# Altium project Alt_BRD_PowerModules.PrjPcb (part 2 of 2)
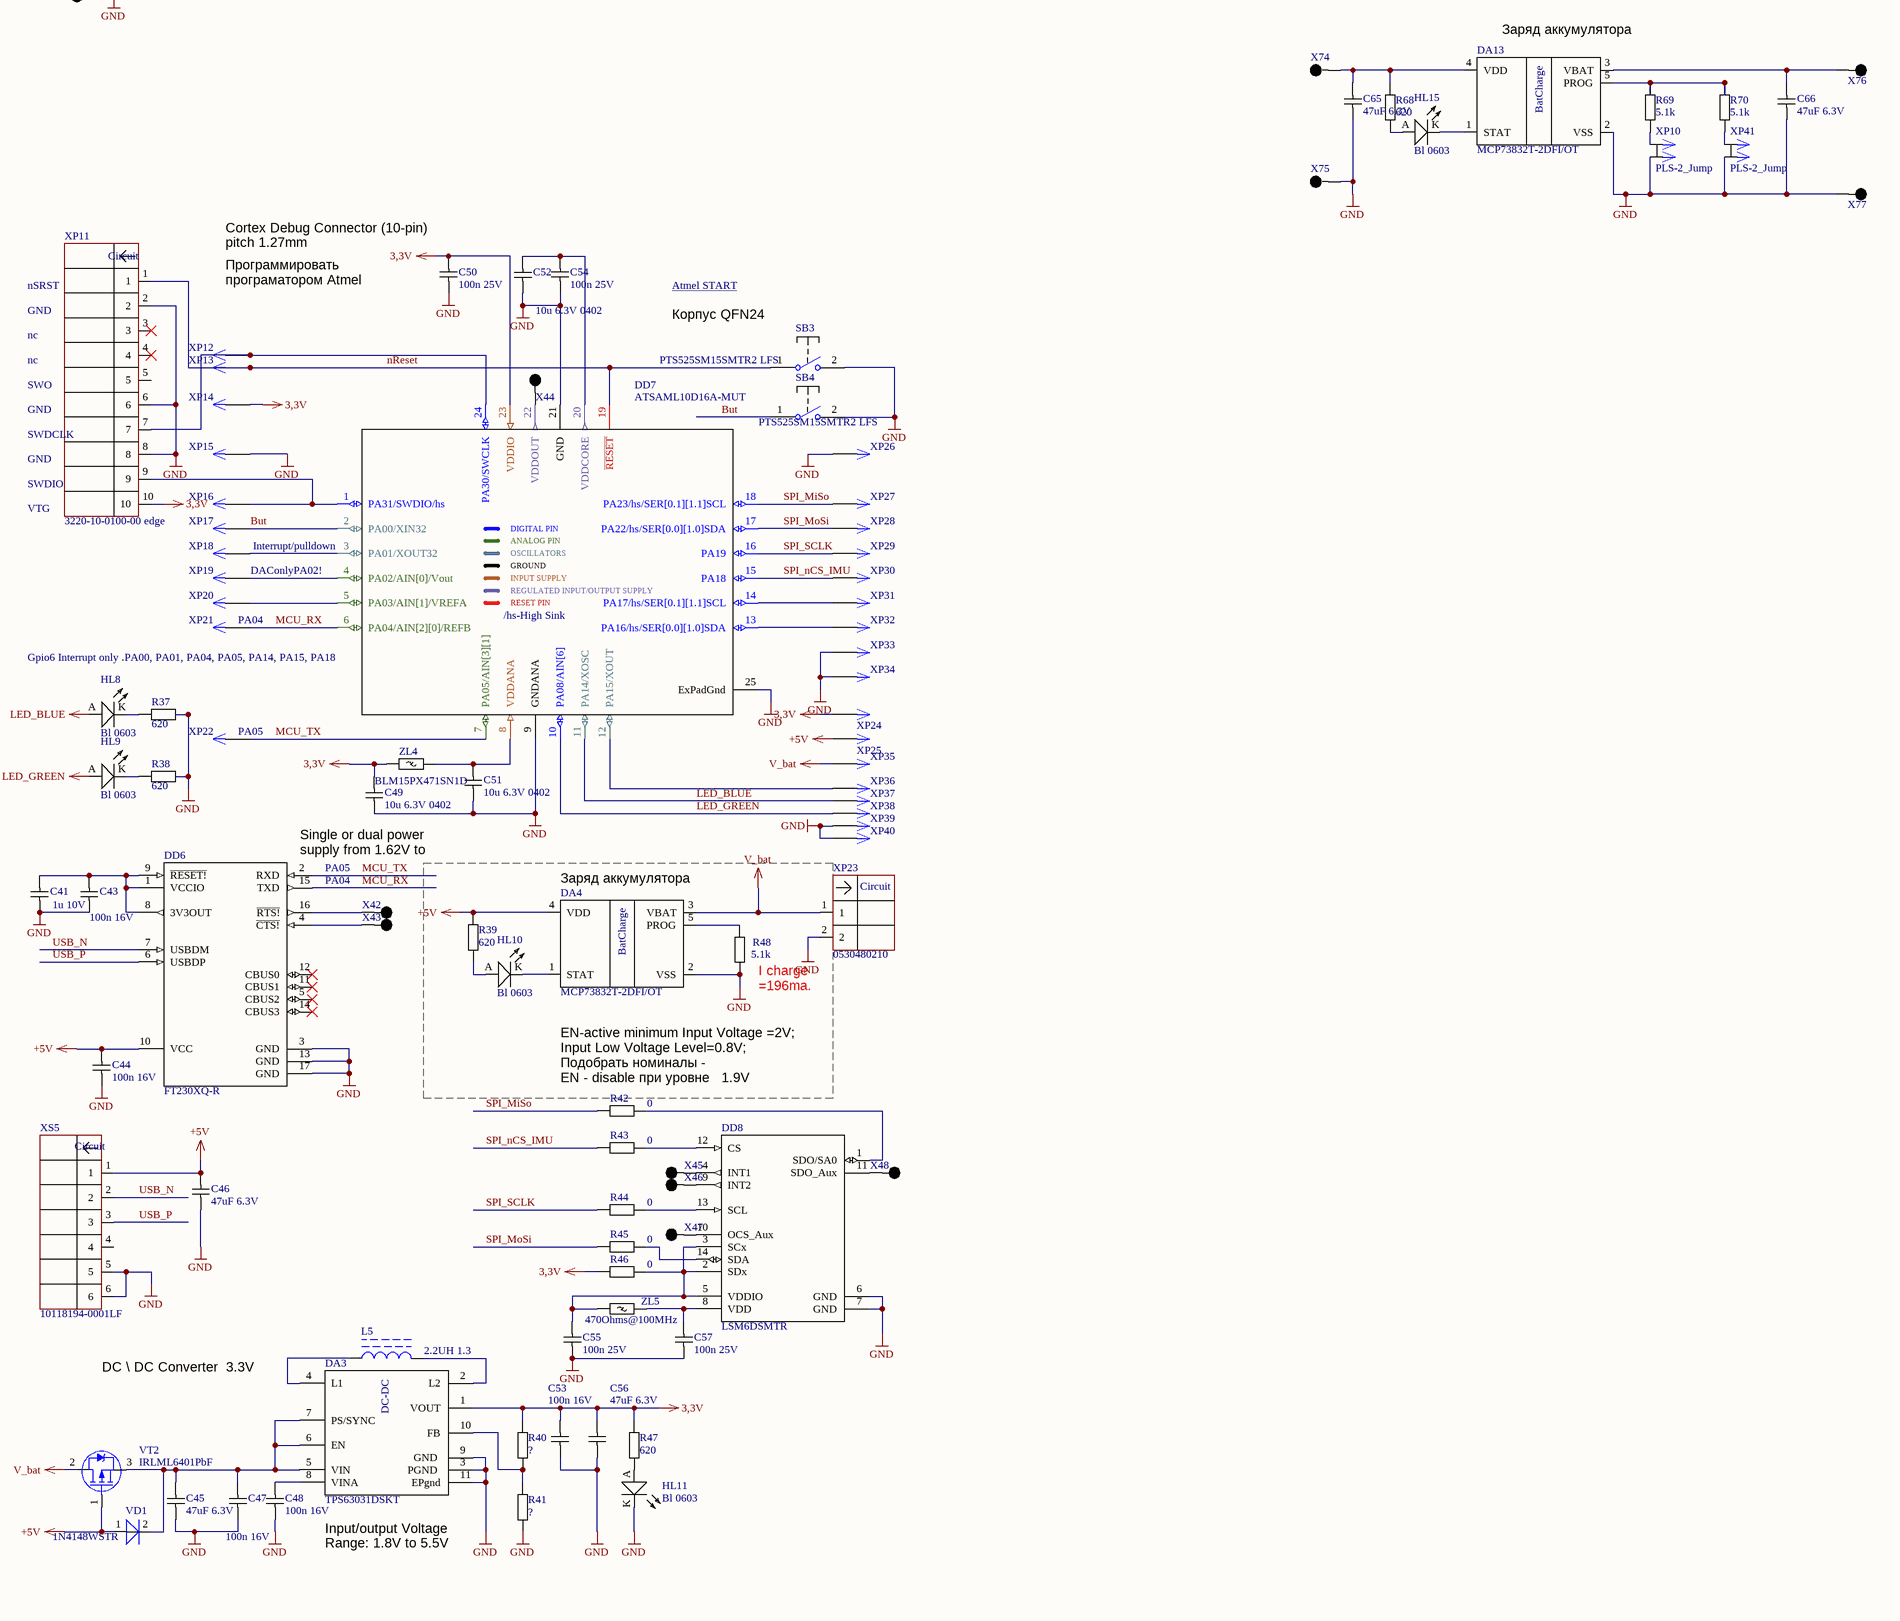
[diagram p4: Alt_BRD_PowerModules.SchDoc, bottom right]

## Sheet Alt_BRD_PowerModules.SchDoc (continued)

### Library data of the parts
C1 = GRM155R61A475MEAAD: CAP CER 4.7UF 10V X5R 0402; Part Number: GRM155R61A475MEAAD; HelpURL: https://www.digikey.com/product-detail/en/GRM155R61A475MEAAD/490-14306-1-ND/6234742/?itemSeq=332893833; Digi-Key Part Number: 490-14306-1-ND; Price$: 0.04954; Manufacturer Part Number: GRM155R61A475MEAAD; Package: 0402
C2 C4 C6 C10 C58 = LMK105BJ225MV-F: CAP CER 2.2uF 10V X5R 0402; Part Number: LMK105BJ225MV-F; Digi-Key Part Number: 587-3153-1-ND; HelpURL: https://www.digikey.com/en/products/detail/taiyo-yuden/LMK105BJ225MV-F/2774764; Manufacturer Part Number: LMK105BJ225MV-F; Price$: 0.01452; Package: 0402
C3 C8 C15 = 04023C104KAT2A: 0.1µF ±10% 25V Ceramic Capacitor X7R 0402 (1005 Metric); Part Number: 04023C104KAT2A; HelpURL: https://www.digikey.com/en/products/detail/avx-corporation/04023C104KAT2A/3079747; Digi-Key Part Number: 478-7868-1-ND; Price$: 0.1; Manufacturer Part Number: 04023C104KAT2A; Mouser Part Number: 478-7868-1-ND
C5 = CC0402KRX7R9BB103: 10nF 0402 50V X7R  +/-10%; Part Number: CC0402KRX7R9BB103; HelpURL: https://eu.mouser.com/ProductDetail/Yageo/CC0402KRX7R9BB103?qs=%2Fha2pyFaduhfwZVzbL0cyr%2Fi%2F48Qij%2FpexQf186TfJSesVd37kSFIA%3D%3D; Price$: 0.1; Manufacturer Part Number: CC0402KRX7R9BB103; Package: 0402; Mouser Part Number: 603-CC402KRX7R9BB103
C7 C9 C16 C18 C27 C31 C35 C36 = CAPC1005(0402)N: CAP CER 10UF 6.3V X5R 0402; Manufacturer Part Number: GRJ155R60J106ME11D; Part Number: CAPC1005(0402)N; HelpURL: https://www.digikey.com/product-detail/en/murata-electronics-north-america/GRJ155R60J106ME11D/490-13211-1-ND/5877419; Digi-Key Part Number: 490-13211-1-ND; Price$: 0.24; Code_JEDEC: 0402
C11 C13 C19 C23 C24 C30 C32 C39 C55 C57 C59 = CL05B104KA5NNNC: CAP CER 0.1UF 25V X7R 0402; Part Number: CL05B104KA5NNNC; Digi-Key Part Number: 1276-6720-1-ND; HelpURL: https://www.digikey.com/en/products/detail/samsung-electro-mechanics/CL05B104KA5NNNC/5961204; Manufacturer Part Number: CL05B104KA5NNNC; Price$: 0.00487; Package: 0402
C12 = CL05C100DB5NNNC: CAP CER 10PF 50V C0G/NP0 0402; Part Number: CL05C100DB5NNNC; HelpURL: https://www.digikey.com/en/products/detail/samsung-electro-mechanics/CL05C100DB5NNNC/3887283; Digi-Key Part Number: 1276-1625-1-ND; Price$: 0.00647; Manufacturer Part Number: CL05C100DB5NNNC; Package: 0402
C14 = CL05B103KB5NNNC: CAP CER 10000PF 50V X7R 0402; Part Number: CL05B103KB5NNNC; HelpURL: https://www.digikey.com/en/products/detail/samsung-electro-mechanics/CL05B103KB5NNNC/3886686; Digi-Key Part Number: 1276-1028-1-ND; Price$: 0.00399; Manufacturer Part Number: CL05B103KB5NNNC; Package: 0402
C17 = CAPC1005(0402)N: Part Number: CAPC1005(0402)N; Package: 0402
C20 C41 = CAPC1005(0402)N: CAP CER 1UF 10V 10% X6S 0402; Manufacturer Part Number: LMK105BJ105KPLF; Part Number: CAPC1005(0402)N; HelpURL: https://eu.mouser.com/ProductDetail/Taiyo-Yuden/LMK105BJ105KPLF?qs=sGAEpiMZZMs0AnBnWHyRQIHQ3Mw87cdo1QzgwSlYWOQcjHYBR0FFrA%3D%3D; Price$: 0.11; Package: 0402; Mouser Part Number: 963-LMK105BJ105KPLF
C21 C22 = CC0402JRNPO9BN200: 20pF ±5% 50V Ceramic Capacitor C0G, NP0 0402 (1005 Metric); Part Number: CC0402JRNPO9BN200; HelpURL: https://www.digikey.com/en/products/detail/yageo/CC0402JRNPO9BN200/2833582; Digi-Key Part Number: 311-1417-1-ND; Price$: 0,1; Manufacturer Part Number: CC0402JRNPO9BN200
C25 = CAPC1005(0402)N: CAP CER 1UF 10V 10% X6S 0402; Manufacturer Part Number: CL05X105KP5NNNC; Part Number: CAPC1005(0402)N; Digi-Key Part Number: 1276-6805-1-ND; HelpURL: https://www.digikey.com/product-detail/en/samsung-electro-mechanics/CL05X105KP5NNNC/1276-6805-1-ND/5961664; Price$: 0.11; Code_JEDEC: 0402
C26 = CAPC1005(0402)N: CAP CER 0.1UF 25V X5R 0402; Manufacturer Part Number: 885012105018; Part Number: CAPC1005(0402)N; Digi-Key Part Number: 732-7495-1-ND; HelpURL: https://www.digikey.com/product-detail/en/wurth-electronics-inc/885012105018/732-7495-1-ND/5454122; Price$: 0.11; Code_JEDEC: 0402
C28 = CAPC1005(0402)N: CAP CER 0.047UF 50V X7R 0402; Manufacturer Part Number: GCM155R71H473KE02D; Part Number: CAPC1005(0402)N; Digi-Key Part Number: 490-13297-1-ND; HelpURL: https://www.digikey.com/product-detail/en/murata-electronics-north-america/GCM155R71H473KE02D/490-13297-1-ND/5973321; Price$: 0.1; Code_JEDEC: 0402
C29 = CAPC1005(0402)N: CAP CER 4.7UF ±20% 10V X5R 0402; Manufacturer Part Number: GRM155R61A475MEAAD; Part Number: CAPC1005(0402)N; Digi-Key Part Number: 490-14306-1-ND; HelpURL: https://www.digikey.com/product-detail/en/murata-electronics-north-america/GRM155R61A475MEAAD/490-14306-1-ND/6234742; Price$: 0.23; Code_JEDEC: 0402
C33 C34 = CC0402DRNPO9BN100: 10pF 0402 50V C0G  +/-0.5pF; Part Number: CC0402DRNPO9BN100; HelpURL: https://www.digikey.com/en/products/detail/yageo/CC0402DRNPO9BN100/2297890?s=N4IgTCBcDaIMJwAwBZFgCICUByAFA8gJwBC2AjIoiALoC%2BQA; Price$: 0.1; Manufacturer Part Number: CC0402DRNPO9BN100; Package: 0402; Mouser Part Number: 603-CC402DRNPO9BN100
C37 C38 C42 = GCM1555C1H151JA16D: 150pF 0402 50V NP0  +/-5%; Part Number: GCM1555C1H151JA16D; HelpURL: https://eu.mouser.com/ProductDetail/Murata-Electronics/GCM1555C1H151JA16D?qs=%2Fha2pyFadugcbh64YeyVIuIl%252BPkOajCwN%252Ba25dmljYEPyTqNgKhHVA%3D%3D; Price$: 0.1; Manufacturer Part Number: GCM1555C1H151JA16D; Package: 0402; Mouser Part Number: 81-GCM1555C1H151J16D
C40 = CL05C1R5BB5NNNC: CAP CER 1.5pF 50V COG 0402 ±0.1pF; Part Number: CL05C1R5BB5NNNC; HelpURL: https://www.digikey.com/en/products/detail/samsung-electro-mechanics/CL05C1R5BB5NNNC/3887314; Digi-Key Part Number: 1276-1656-1-ND; Price$: 0.00874; Manufacturer Part Number: CL05C1R5BB5NNNC; Package: 0402
C43 C44 C47 C48 C53 C61-C63 C68 = CL05F104ZO5NNNC: Cap Cer 0.1uF 16V 1% C0G(NP0) MLCC; Part Number: CL05F104ZO5NNNC; HelpURL: https://www.digikey.com/product-detail/en/CL05F104ZO5NNNC/1276-1004-1-ND/3889090/?itemSeq=332907103; Digi-Key Part Number: 1276-1004-1-ND; Price$: 0.00475; Manufacturer Part Number: CL05F104ZO5NNNC; Package: 0402
C45 C46 C56 C60 C64-C66 = GRM188R60J476ME15D: CAP CER 47UF 6.3V X5R 0603; Part Number: GRM188R60J476ME15D; HelpURL: https://www.digikey.com/en/products/detail/murata-electronics/GRM188R60J476ME15D/5877410; Digi-Key Part Number: 490-13247-1-ND; Price$: 0.16924; Manufacturer Part Number: GRM188R60J476ME15D; Package: 0603
C49 C51 C52 C67 = CAPC1608(0603): CAP CER 10UF 6.3V X5R 0402; Manufacturer Part Number: GRJ155R60J106ME11D; Part Number: CAPC1608(0603); HelpURL: https://www.digikey.com/product-detail/en/murata-electronics-north-america/GRJ155R60J106ME11D/490-13211-1-ND/5877419; Digi-Key Part Number: GRJ155R60J106ME11D; Price$: 0.22; Code_JEDEC: 0402
C50 C54 = CAPC1608(0603): CAP CER 0.1UF 25V X5R 0402; Manufacturer Part Number: 885012105018; Part Number: CAPC1608(0603); Digi-Key Part Number: 732-7495-1-ND; HelpURL: https://www.digikey.com/product-detail/en/wurth-electronics-inc/885012105018/732-7495-1-ND/5454122; Price$: 0.11; Code_JEDEC: 0402
DA1 DA5 = MIC5317-3.3YM5-TR: Linear Voltage Regulator IC 1 Output 150mA SOT-23-5; Part Number: MIC5317-3.3YM5-TR; HelpURL: https://www.digikey.com/product-detail/en/microchip-technology/MIC5317-3.3YM5-TR/MIC5317-3.3YM5-CT-ND/7671939; Price$: 0,16; Digi-Key Part Number: MIC5317-3.3YM5-CT-ND; Manufacturer Part Number: MIC5317-3.3YM5-TR
DA2 = BQ25606RGER: IC BATT CHG LI-ION 1 CELL 24VQFN; Part Number: BQ25606RGER; HelpURL: https://www.digikey.com/product-detail/en/texas-instruments/BQ25606RGER/296-47743-1-ND/8133092; Price$: 2.76; Digi-Key Part Number: 296-47743-1-ND; Manufacturer Part Number: BQ25606RGER
DA3 DA6 = TPS63031DSKT: IC REG BCK BST 3.3V 900MA 10SON; Part Number: TPS63031DSKT; HelpURL: https://www.digikey.com/en/products/detail/texas-instruments/TPS63031DSKT/1967863; Price$: 2,28; Digi-Key Part Number: 296-23904-1-ND; Manufacturer Part Number: TPS63031DSKT
DA4 DA7 DA13 = MCP73832T-2DFI/OT: IC LI-ION/LI-POLY CTRLR SOT23-5; Part Number: MCP73832T-2DFI/OT; HelpURL: https://www.digikey.com/product-detail/en/MCP73832T-2DFI%2fOT/MCP73832T-2DFI%2fOTCT-ND/2060344/?itemSeq=274027917; Digi-Key Part Number: MCP73832T-2DFI/OTCT-ND
DA8 = MIC2019YM6-TR: IC DISTRIBUTION SW ADJ SOT23-6; Part Number: MIC2019YM6-TR; HelpURL: https://www.digikey.com/product-detail/en/microchip-technology/MIC2019YM6-TR/576-2595-1-ND/1821755; Price$: 0.38; Digi-Key Part Number: 576-2595-1-ND; Manufacturer Part Number: MIC2019YM6-TR; Package: SOT-23-6
DA9 DA11 DA12 = LTV-816S: OPTOISOLATR 5KV TRANSISTOR 4-SMD; Part Number: LTV-816S; HelpURL: https://www.digikey.com/en/products/detail/lite-on-inc/LTV-816S/385831; Price$: 0.11340; Digi-Key Part Number: 160-1361-5-ND; Manufacturer Part Number: LTV-816S; Package: SMD-4pin
DA10 = LTC6993CS6-3#TRMPBF: IC MONO MULTIVIBRATOR TSOT23-6; Part Number: LTC6993CS6-3#TRMPBF; HelpURL: https://www.digikey.com/product-detail/en/linear-technology-analog-devices/LTC6993CS6-3-TRMPBF/LTC6993CS6-3-TRMPBFDKR-ND/2404487; Price$: 3.49; Digi-Key Part Number: LTC6993CS6-3#TRMPBFDKR-ND; Manufacturer Part Number: LTC6993CS6-3#TRMPBF; Package: SOT23-6
DD1 = MAX8903AETI+: IC BATT CHG LI-ION 1CELL 28TQFN; Manufacturer_Name: Maxim Integrated; Datasheet Link: https://componentsearchengine.com/Datasheets/2/MAX8903AETI+.pdf; Height: 0.8mm; Manufacturer_Part_Number: MAX8903AETI+; Mouser Part Number: 700-MAX8903AETI; Mouser Price/Stock: https://www.mouser.co.uk/ProductDetail/Maxim-Integrated/MAX8903AETI%2b?qs=Mqkh4jHMT8xkuEtUKQzR8g%3D%3D; Part Number: MAX8903AETI+; HelpURL: https://www.digikey.com/en/products/detail/maxim-integrated/MAX8903AETI/2061975; Price$: 4.02000; Digi-Key Part Number: MAX8903AETI+-ND; Manufacturer Part Number: MAX8903AETI+
DD2 = MAX17047G+T10: IC BATT MONITOR LI-ION 10TDFN; Part Number: MAX17047G+T10; HelpURL: https://www.digikey.com/en/products/detail/maxim-integrated/MAX17047G-T10/3758920?s=N4IgTCBcDaILIEEAaBGA7ABgCxpAXQF8g; Digi-Key Part Number: MAX17047G+T10-ND; Manufacturer Part Number: MAX17047G+T10; Package: TDFN-10
DD3 = CYW20737A1KML2G: IC RF TXRX+MCU BLUETOOTH 32VFQFN; Part Number: CYW20737A1KML2G; HelpURL: https://www.digikey.com/en/products/detail/cypress-semiconductor-corp/CYW20737A1KML2G/6592884; Price$: 0,86; Digi-Key Part Number: 2015-CYW20737A1KML2G-ND; Manufacturer Part Number: CYW20737A1KML2G
DD4 DD8 = LSM6DSMTR: IMU ACCEL/GYRO I2C/SPI 14LGA; SourceLibrary: Updates_to_database_2020-11-03; Built_By: EMA_Cory; Vendor: STMicroelectronics; HelpURL2: #https://www.digikey.com/product-detail/en/stmicroelectronics/LSM6DSMTR/497-16696-1-ND/6192778#; Datasheet: https://www.st.com/content/ccc/resource/technical/document/datasheet/76/27/cf/88/c5/03/42/6b/DM00218116.pdf/files/DM00218116.pdf/jcr:content/translations/en.DM00218116.pdf; Copyright: Copyright (C) 2018 Accelerated Designs. All rights reserved; Manufacturer_Part_Number: LSM6DSMTR; RefDes: RefDes; Type: DEV; Part Number: LSM6DSMTR; HelpURL: https://eu.mouser.com/ProductDetail/STMicroelectronics/LSM6DSMTR?qs=dTJS0cRn7ogKkf7uVmbVmg%3D%3D; Price$: 2.92; Digi-Key Part Number: 497-16696-1-ND; Manufacturer Part Number: LSM6DSMTR; Mouser Part Number: 511-LSM6DSMTR
DD5 = MX25R4035FM1IL0: IC FLASH 4M SPI 33MHZ 8SOP; Note: SOP 8L(150mil); Part Number: MX25R4035FM1IL0; HelpURL: https://www.digikey.com/en/products/detail/macronix/MX25R4035FM1IL0/6558612; Digi-Key Part Number: MX25R4035FM1IL0; Manufacturer Part Number: MX25R4035FM1IL0; Package: 8-SOP
DD6 = FT230XQ-R: IC USB SERIAL BASIC UART 16QFN; Part Number: FT230XQ-R; HelpURL: https://www.digikey.com/en/products/detail/ftdi-future-technology-devices-international-ltd/FT230XQ-R/3029142; Price$: 2,04; Digi-Key Part Number: 768-1130-1-ND; Manufacturer Part Number: FT230XQ-R
DD7 = ATSAML10D16A-MUT: IC MCU 32BIT 64KB FLASH 24VQFN,ARM® Cortex®-M23; Part Number: ATSAML10D16A-MUT; HelpURL: https://www.digikey.com/product-detail/en/microchip-technology/ATSAML10D16A-MUT/ATSAML10D16A-MUTCT-ND/9360576; Price$: 1.82; Digi-Key Part Number: ATSAML10D16A-MUTCT-ND; Manufacturer Part Number: ATSAML10D16A-MUT; Code_JEDEC: VQFN-24
G1 = TSX-3225 24.0000MF15X-AC6: 24MHz ±10ppm Crystal 9pF 40 Ohms 4-SMD, No Lead; Part Number: TSX-3225 24.0000MF15X-AC6; HelpURL: https://www.digikey.com/en/products/detail/epson/TSX-3225-24-0000MF15X-AC6/5261221; Price$: 0.33; Digi-Key Part Number: SER4180CT-ND; Manufacturer Part Number: TSX-3225 24.0000MF15X-AC6
G2 = VMK3-9005-32K7680000: 32.768kHz ±20ppm Crystal   2-SMD, No Lead; Part Number: VMK3-9005-32K7680000; HelpURL: https://www.digikey.com/en/products/detail/microchip-technology/VMK3-9005-32K7680000/13175117; Price$: 0.34; Digi-Key Part Number: 150-VMK3-9005-32K7680000CT-ND; Manufacturer Part Number: VMK3-9005-32K7680000
HL1-HL7 = 150060VS55040: LED GREEN DIFFUSED 0603 SMD; Part Number: 150060VS55040; HelpURL: https://www.mouser.com/ProductDetail/Wurth-Elektronik/150060VS55040?qs=%2Fha2pyFaduhwKZlJ%252BauMPGbe2qb%2FJX%2FXBiS9WUTr3iltzze5OTUvag%3D%3D; Digi-Key Part Number: 732-12017-1-ND; Price$: 0.115; Manufacturer Part Number: 150060VS55040; Package: 0603; Mouser Part Number: 710-150060VS55040
HL8-HL17 = 150060BS55040: LED BLUE DIFFUSED 0603 SMD; Part Number: 150060BS55040; HelpURL: https://www.digikey.com/products/en?keywords=732-12013-1-ND; Digi-Key Part Number: 732-12013-1-ND; Manufacturer Part Number: 150060BS55040; Package: 0603
K1 = SRS-05VDC-SL: Part Number: SRS-05VDC-SL; HelpURL: https://3v3.com.ua/product_1552.html; Manufacturer Part Number: SRS-05VDC-SL
L1 = SDE0805A-2R5M: FIXED IND 2.5UH 5A 27 MOHM SMD; Published: 24-Mar-1999; LatestRevisionDate: 17-Jul-2002; LatestRevisionNote: Re-released for DXP Platform.; PackageReference: AXIAL-0.9; Publisher: Altium Limited; PackageDescription: Axial Device, Thru-Hole; 2 Leads; 0.9 in Pin Spacing; Part Number: SDE0805A-2R5M; HelpURL: https://www.digikey.com/en/products/detail/bourns-inc/SDE0805A-2R5M/5031088; Price$: 0.27200; Digi-Key Part Number: SDE0805A-2R5MCT-ND; Manufacturer Part Number: SDE0805A-2R5M; Mouser Part Number: 652-SDE0805A-2R5M
L2 = NRS4018T1R0NDGJ: FIXED IND 1UH 3.2A 32.4 MOHM SMD; Part Number: NRS4018T1R0NDGJ; HelpURL: https://www.digikey.com/product-detail/en/taiyo-yuden/NRS4018T1R0NDGJ/587-2888-1-ND/2649008; Digi-Key Part Number: 587-2888-1-ND; Price$: 0.29; Manufacturer Part Number: NRS4018T1R0NDGJ
L3 L4 = AISC-0603-R27G-T: Fixed Inductors 270nH 2% -40C +125C; Part Number: AISC-0603-R27G-T; HelpURL: https://eu.mouser.com/ProductDetail/ABRACON/AISC-0603-R27G-T?qs=%2Fha2pyFaduhMG%2FX31G0KOK4wVUuURxruJbjcpPhZfbyFA8e1ZTy%2F3Q%3D%3D; Manufacturer Part Number: AISC-0603-R27G-T; Mouser Part Number: 815-AISC0603R27GT
L5 L6 = CDRH2D11/HPNP-2R2NC: FIXED IND 2.2UH 1.3A 120 MOHM; Published: 24-Mar-1999; LatestRevisionDate: 17-Jul-2002; LatestRevisionNote: Re-released for DXP Platform.; PackageReference: AXIAL-0.9; Publisher: Altium Limited; PackageDescription: Axial Device, Thru-Hole; 2 Leads; 0.9 in Pin Spacing; Part Number: CDRH2D11/HPNP-2R2NC; HelpURL: https://www.digikey.com/product-detail/en/sumida-america-components-inc/CDRH2D11-HPNP-2R2NC/308-1578-1-ND/2620850; Price$: 0.69; Digi-Key Part Number: 308-1578-1-ND; Manufacturer Part Number: CDRH2D11/HPNP-2R2NC
R1 R6 R17-R19 R21-R23 = RESC1005(0402): RES 10K OHM 1% 1/16W 0402; Manufacturer Part Number: CRCW040210K0FKEDC; Part Number: RESC1005(0402); HelpURL: https://eu.mouser.com/ProductDetail/Vishay-Dale/CRCW040210K0FKEDC?qs=sGAEpiMZZMvdGkrng054t0DrEhLhGh8ghRTPC4LoFoV0V5heIyAs3Q%3D%3D; Price$: 0.1; Package: 0402; Mouser Part Number: 71-CRCW040210K0FKEDC
R2 R36 R42-R46 = RMCF0402ZT0R00: RES SMD 0402 0 Ohm; Part Number: RMCF0402ZT0R00; HelpURL: https://www.digikey.com/en/products/detail/stackpole-electronics-inc/RMCF0402ZT0R00/1756905; Manufacturer Part Number: RMCF0402ZT0R00; Price$: 0.00186; Package: 0402; Mouser Part Number: RMCF0402ZT0R00CT-ND
R3 R7 R14 R15 R26-R32 R37-R41 R47 R50 R56-R59 R64 R68 = RESC1005(0402): Part Number: RESC1005(0402); Package: 0402
R4 R10 R16 R20 R48 R49 R51 R60-R63 R69 R70 = RESC1005(0402): RES SMD 5.1K OHM 1% 1/10W 0402; Manufacturer Part Number: ERJ-2RKF5101X; Part Number: RESC1005(0402); HelpURL: https://eu.mouser.com/ProductDetail/ROHM-Semiconductor/SFR01MZPF5101?qs=sGAEpiMZZMvdGkrng054t7z4BkURc4Lz8VVRSaz2ejIiXEQeYNXBXw%3D%3D; Price$: 0.1; Package: 0402; Mouser Part Number: 755-SFR01MZPF5101
R5 = RESC1005(0402): RES SMD 620 OHM 1% 1/16W 0402; Manufacturer Part Number: RC0402FR-07620RL; Part Number: RESC1005(0402); HelpURL: https://www.digikey.com/product-detail/en/yageo/RC0402FR-07620RL/311-620LRCT-ND/729595; Digi-Key Part Number: 311-620LRCT-ND; Price$: 0.1; Code_JEDEC: 0402
R8 = RESC1005(0402): RES SMD 158 OHM 1% 1/10W 0402; Manufacturer Part Number: ERJ-2RKF1580X; Part Number: RESC1005(0402); Digi-Key Part Number: P158LCT-ND; HelpURL: https://www.digikey.com/product-detail/en/panasonic-electronic-components/ERJ-2RKF1580X/P158LCT-ND/194195; Price$: 0.1; Code_JEDEC: 0402
R9 = RESC1005(0402): RES SMD 1K OHM 0.5% 1/16W 0402; Manufacturer Part Number: RR0510P-102-D; Part Number: RESC1005(0402); Digi-Key Part Number: RR05P1.0KDCT-ND; HelpURL: https://www.digikey.com/product-detail/en/susumu/RR0510P-102-D/RR05P1.0KDCT-ND/432937; Price$: 0.1; Code_JEDEC: 0402
R11 = RESC1005(0402): RES 221 OHM 1% 1/16W 0402; Manufacturer Part Number: RMCF0402FT221R; Part Number: RESC1005(0402); Digi-Key Part Number: RMCF0402FT221RCT-ND; HelpURL: https://www.digikey.com/product-detail/en/stackpole-electronics-inc/RMCF0402FT221R/RMCF0402FT221RCT-ND/2417580; Price$: 0.1; Code_JEDEC: 0402
R12 = RESC1005(0402): RES 2.8K OHM 1% 1/10W 0402; Manufacturer Part Number: RK73H1ETTP2801F; Part Number: RESC1005(0402); Digi-Key Part Number: 2019-RK73H1ETTP2801FCT-ND; HelpURL: https://www.digikey.com/product-detail/en/koa-speer-electronics-inc/RK73H1ETTP2801F/2019-RK73H1ETTP2801FCT-ND/9846507; Price$: 0.1; Code_JEDEC: 0402
R13 = KRL1220E-M-R010-F-T5: RES SMD 0805 10m 1% 50ppm; Part Number: KRL1220E-M-R010-F-T5; HelpURL: https://www.digikey.com/en/products/detail/susumu/KRL1220E-M-R010-F-T5/3737970; Price$: 0.09440; Manufacturer Part Number: KRL1220E-M-R010-F-T5; Package: 0805; Mouser Part Number: 408-1544-1-ND
R24 R25 = RESC1005(0402): RES SMD 2.2K OHM 1% 1/16W 0402; Manufacturer Part Number: RC0402FR-072K2L; Part Number: RESC1005(0402); Digi-Key Part Number: 311-2.20KLRCT-ND; HelpURL: https://www.digikey.com/product-detail/en/yageo/RC0402FR-072K2L/311-2.20KLRCT-ND/729500; Price$: 0.1; Code_JEDEC: 0402
R33 = RESC1005(0402): RES 5.23K OHM 1% 1/16W 0402; Manufacturer Part Number: RMCF0402FT5K23; Part Number: RESC1005(0402); Digi-Key Part Number: RMCF0402FT5K23CT-ND; HelpURL: https://www.digikey.com/product-detail/en/stackpole-electronics-inc/RMCF0402FT5K23/RMCF0402FT5K23CT-ND/2417743; Price$: 0.1; Code_JEDEC: 0402
R34 = RMCF0402JT10M0: RES SMD 0402 10 MOhm 5% 200ppm; Part Number: RMCF0402JT10M0; HelpURL: https://www.digikey.com/en/products/detail/stackpole-electronics-inc/RMCF0402JT10M0/1758210; Digi-Key Part Number: RMCF0402JT10M0CT-ND; Price$: 0.00186; Manufacturer Part Number: RMCF0402JT10M0; Package: 0402
R35 = RESC1005(0402): RES 30.1K OHM 1% 1/16W 0402; Manufacturer Part Number: RMCF0402FT30K1; Part Number: RESC1005(0402); Digi-Key Part Number: RMCF0402FT30K1CT-ND; HelpURL: https://www.digikey.com/product-detail/en/stackpole-electronics-inc/RMCF0402FT30K1/RMCF0402FT30K1CT-ND/4250677; Price$: 0.1; Code_JEDEC: 0402
R52-R55 R65-R67 = RESC1608(0603): Part Number: RESC1608(0603); Package: 0603
RP1-RP4 = 10K: Trimm Res TH 3/8  10K  0,5W  100ppm Vert Adj; Manufacturer Part Number: 3296W-1-103LF; Part Number: 10K; HelpURL: https://eu.mouser.com/ProductDetail/Bourns/3296W-1-103LF?qs=CL3xLxiry19Id6AEaxYcng%3D%3D; Mouser Part Number: 652-3296W-1-103LF
RP5 RP6 = Pot. 3296W: Manufacturer Part Number: ???; Part Number: Pot. 3296W; HelpURL: https://www.bourns.com/pdfs/3296.pdf
SB1-SB4 = PTS525SM15SMTR2 LFS: SWITCH TACTILE SPST-NO 0.02A 15V; Part Number: PTS525SM15SMTR2 LFS; HelpURL: https://www.digikey.com/products/en?keywords=CKN9104CT-ND; Digi-Key Part Number: CKN9104CT-ND; Price$: 0.33; Manufacturer Part Number: PTS525SM15SMTR2 LFS
TP1 = TP-PLLS1.27-1-R: Part Number: TP-PLLS1.27-1-R
VD1 VD2 = 1N4148WSTR: DIODE GEN PURP 75V 300MA SOD323; Published: 8-Jun-2000; LatestRevisionDate: 17-Jul-2002; LatestRevisionNote: Re-released for DXP Platform.; DatasheetVersion: 1997; PackageReference: DO-35; Publisher: Altium Limited; PackageDescription: Diode, Axial; Body 3.8 x 1.9 mm (LxDia. max), Lead Dia. 0.53 mm (max); Code_JEDEC: DO-204-AH; ComponentLink1Description: Manufacturer Link; ComponentLink1URL: http://www.fairchildsemi.com/; ComponentLink2Description: Datasheet; ComponentLink2URL: http://www.fairchildsemi.com/ds/1N%2F1N4148.pdf; Part Number: 1N4148WSTR; HelpURL: https://www.digikey.com/product-detail/en/smc-diode-solutions/1N4148WSTR/1655-1359-1-ND/6022804; Digi-Key Part Number: 1655-1359-1-ND; Price$: ?; Note: ?; Manufacturer Part Number: ?; Package: ?
VD3-VD5 = BAT54J: Schottky Diode 30V 0,2A  SOD-323-2; Manufacturer Part Number: BAT54J,115; Published: 8-Jun-2000; LatestRevisionDate: 17-Jul-2002; LatestRevisionNote: Re-released for DXP Platform.; DatasheetVersion: 1997; PackageReference: DO-35; Publisher: Altium Limited; PackageDescription: Diode, Axial; Body 3.8 x 1.9 mm (LxDia. max), Lead Dia. 0.53 mm (max); Code_JEDEC: DO-204-AH; ComponentLink1Description: Manufacturer Link; ComponentLink1URL: http://www.fairchildsemi.com/; ComponentLink2Description: Datasheet; ComponentLink2URL: http://www.fairchildsemi.com/ds/1N%2F1N4148.pdf; Part Number: BAT54J; HelpURL: https://eu.mouser.com/ProductDetail/Nexperia/BAT54J115?qs=me8TqzrmIYVxNBNrx1zKWQ%3D%3D; Price$: 0.06; Mouser Part Number: 771-BAT54J115
VT1 VT2 = IRLML6401PbF: Note: ???; Part Number: IRLML6401PbF; HelpURL: https://www.infineon.com/dgdl/irlml6401pbf.pdf?fileId=5546d462533600a401535668b96d2634; Digi-Key Part Number: ???; Price$: ???; Manufacturer Part Number: ???; Package: ???
VT3 = BC848: TRANS NPN 30V 100MA SC70-3; Part Number: BC848; HelpURL: http://www.nxp.com/documents/data_sheet/BC848_SER.pdf
VT5 = RUC002N05HZGT116: N-Channel 50V 200mA (Ta) 350mW (Ta) Surface Mount SST3; Part Number: RUC002N05HZGT116; HelpURL: https://media.digikey.com/pdf/Data%20Sheets/Rohm%20PDFs/RUC002N05HZGT116_Rev.001_6-6-16.pdf; Digi-Key Part Number: RUC002N05HZGT116CT-ND; Price$: 0.03825; Manufacturer Part Number: RUC002N05HZGT116; Package: SOT-23-3
VT6 = SI2347DS-T1-GE3: Part Number: SI2347DS-T1-GE3; HelpURL: https://www.digikey.com/product-detail/en/vishay-siliconix/SI2347DS-T1-GE3/SI2347DS-T1-GE3CT-ND/5805425
X1-X20 X30-X39 X52-X55 X62-X73 = X1-PLS-1: контакт под пайку; Part Number: X1-PLS-1
XP1-XP3 XP5 XP7 XP8 XP10 XP41 = PLS-2_Jump: CONN HEADER VERT 2POS 2.54MM; Manufacturer Part Number: PRPC002SAAN-RC; Part Number: PLS-2_Jump; HelpURL: https://www.digikey.com/product-detail/en/sullins-connector-solutions/PRPC002SAAN-RC/S1011EC-02-ND/2775252; Digi-Key Part Number: S1011EC-02-ND; Price$: 0.08; Package: Header 2POS 2.54mm
XP4 XP9 = PR20203VBNN: CONN HEADER VERT 3POS 2.54MM; Part Number: PR20203VBNN; HelpURL: https://www.digikey.com/product-detail/en/metz-connect-usa-inc/PR20203VBNN/1849-1003-ND/7794768; Digi-Key Part Number: 1849-1003-ND; Manufacturer Part Number: PR20203VBNN; Package: Header 3POS 2.54mm
XP6 = PLS-3: CONN HEADER VERT 3POS 2.54MM; Manufacturer Part Number: PR20203VBNN; Part Number: PLS-3; HelpURL: https://www.digikey.com/product-detail/en/metz-connect-usa-inc/PR20203VBNN/1849-1003-ND/7794768; Digi-Key Part Number: 1849-1003-ND; Package: Header 3POS 2.54mm
XP11 = 3220-10-0100-00 edge: 3220-10-0100-00; Part Number: 3220-10-0100-00 edge; HelpURL: https://www.digikey.com/product-detail/en/cnc-tech/3220-10-0100-00/1175-1627-ND/3883661; Digi-Key Part Number: 1175-1627-ND; Package: Header 20POS 1.27mm
XP12-XP22 XP24-XP40 = PLS-1: CONN HEADER VERT 1POS; Manufacturer Part Number: PRPC001SAAN-RC; Part Number: PLS-1; HelpURL: https://www.digikey.com/product-detail/en/sullins-connector-solutions/PRPC001SAAN-RC/S1011EC-01-ND/2775253; Digi-Key Part Number: S1011EC-01-ND; Price$: 0.05
XP23 = 0530480210: CONN HEADER R/A 2POS 1.25MM; Part Number: 0530480210; HelpURL: https://www.digikey.com/product-detail/en/molex/0530480210/WM1742-ND/242864; Digi-Key Part Number: WM1742-ND; Price$: 0.3; Manufacturer Part Number: 0530480210
XS1 XS3 = 10118193-0001LF: CONN RCPT USB2.0 MICRO B SMD R/A; Part Number: 10118193-0001LF; HelpURL: https://www.digikey.com/en/products/detail/amphenol-icc-fci/10118193-0001LF/2785388; Digi-Key Part Number: 609-4616-1-ND; Price$: 0.26488; Manufacturer Part Number: 10118193-0001LF
XS5 = 10118194-0001LF: USB Connectors 5P MICRO USB TYPE B RCPT W/ REAR PEGS; Part Number: 10118194-0001LF; HelpURL: https://eu.mouser.com/ProductDetail/Amphenol-FCI/10118194-0001LF?qs=%2Fha2pyFadugHQYubHEjQrWaf71KglMlHbfZ%2FBmSxIoqAM0lAnkBayw%3D%3D; Digi-Key Part Number: 609-4618-1-ND; Price$: 0.265; Manufacturer Part Number: 10118194-0001LF; Mouser Part Number: 649-10118194-0001LF
XT XT1-XT3 = 1984620: TERM BLK 3POS SIDE ENT 3.5MM PCB; HelpURL2: #https://eu.mouser.com/ProductDetail/Phoenix-Contact/1984620?qs=qPbxTIUfeZanCGLWbKOtjg%3D%3D#; Part Number: 1984620; HelpURL: https://www.digikey.com/en/products/detail/phoenix-contact/1984620/950850; Digi-Key Part Number: 277-1722-ND; Price$: 0.51; Manufacturer Part Number: 1984620; Mouser Part Number: 651-1984620
XT4 XT5 = 691137710002: TERM BLK 2POS SIDE ENTRY 5MM PCB; Part Number: 691137710002; HelpURL: https://www.digikey.com/en/products/detail/würth-elektronik/691137710002/6644051; Digi-Key Part Number: 732-10955-ND; Price$: 0.26000; Manufacturer Part Number: 691137710002
ZL1 ZL2 = MMZ1005S601CT000: FERRITE BEAD 600 OHM 0402 1LN; Part Number: MMZ1005S601CT000; HelpURL: https://www.digikey.com/en/products/detail/tdk-corporation/MMZ1005S601CT000/765046; Price$: 0.02280; Digi-Key Part Number: 445-2162-1-ND; Manufacturer Part Number: MMZ1005S601CT000; Package: 0402
ZL3 ZL5 = Ferrite1005(0402): FERRITE BEAD 470 OHM 0402 1LN; Manufacturer Part Number: BLM15PX471SN1D; Part Number: Ferrite1005(0402); Price$: 0.14; Package: 0402; HelpURL: https://eu.mouser.com/ProductDetail/Murata-Electronics/BLM15PX471SN1D?qs=%2Fha2pyFadugFXr5biOyskwIVnWnam4MScgU55pluOIVbLGfRcJswjw%3D%3D; Mouser Part Number: BLM15PX471SN1D
ZL4 = Ferrite1005(0402): FERRITE BEAD 470 OHM 0402 1LN; Part Number: Ferrite1005(0402); Digi-Key Part Number: 490-10662-1-ND; Price$: 0.15; Manufacturer Part Number: BLM15PX471SN1D; Code_JEDEC: 0402
VT4 = BC848: Part Number: BC848; HelpURL: http://www.nxp.com/documents/data_sheet/BC848_SER.pdf
WA1 = INVERTED-F ANTENNA-MIFA  2,4Ghz: Part Number: INVERTED-F ANTENNA-MIFA  2,4Ghz; HelpURL: https://www.cypress.com/file/136236/download
X21-X29 X49-X51 X56-X61 X74-X77 = PLLS1.27-1-R: Part Number: PLLS1.27-1-R
X40-X48 = PLLS1.27-1-TOP-R: Part Number: PLLS1.27-1-TOP-R
XS4 = PBS-7: Part Number: PBS-7